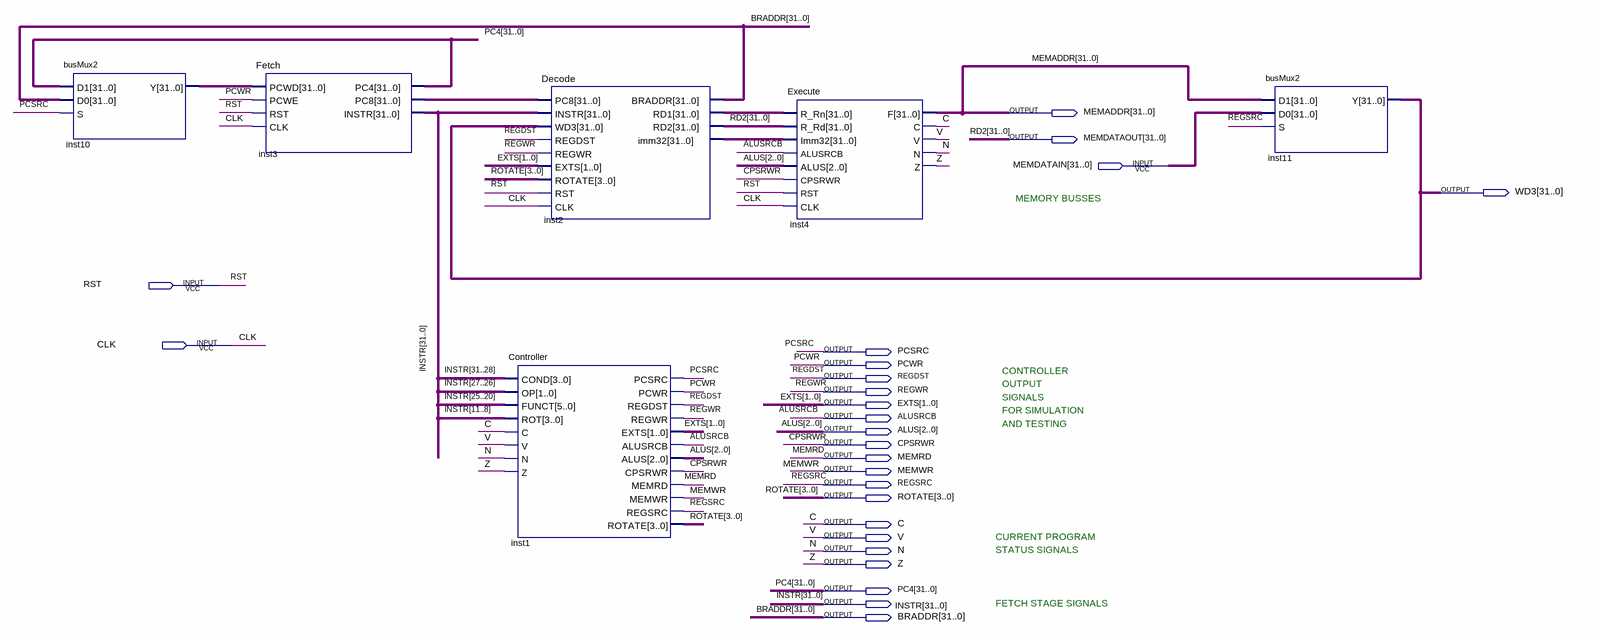
[diagram p0: schematic sheet]
// Quartus schematic SCP.bdf as structural Verilog: 6 symbols, 25 pins
module SCP (
  input  [31:0] MEMDATAIN,
  input  RST,
  input  CLK,
  output [31:0] MEMADDR,
  output [31:0] MEMDATAOUT,
  output [31:0] WD3,
  output PCSRC,
  output PCWR,
  output REGDST,
  output REGWR,
  output [1:0] EXTS,
  output ALUSRCB,
  output [2:0] ALUS,
  output CPSRWR,
  output MEMRD,
  output MEMWR,
  output REGSRC,
  output [3:0] ROTATE,
  output C,
  output V,
  output N,
  output Z,
  output [31:0] PC4,
  output [31:0] INSTR,
  output [31:0] BRADDR
);

  wire [31:0] inst2_imm32, inst2_rd1, inst3_pc8, inst10_y;

  busMux2 inst10 (.D1(PC4), .D0(BRADDR), .S(PCSRC), .Y(inst10_y));
  Fetch inst3 (.PCWD(inst10_y), .PCWE(PCWR), .RST(RST), .CLK(CLK), .PC4(PC4), .PC8(inst3_pc8), .INSTR(INSTR));
  Decode inst2 (
    .PC8(inst3_pc8), .INSTR(INSTR), .WD3(WD3), .REGDST(REGDST), .REGWR(REGWR), .EXTS(EXTS), .ROTATE(ROTATE),
    .RST(RST), .CLK(CLK), .BRADDR(BRADDR), .RD1(inst2_rd1), .RD2(MEMDATAOUT), .imm32(inst2_imm32));
  Controller inst1 (
    .COND(INSTR[31:28]), .OP(INSTR[27:26]), .FUNCT(INSTR[25:20]), .ROT(INSTR[11:8]), .C(C), .V(V), .N(N),
    .Z(Z), .PCSRC(PCSRC), .PCWR(PCWR), .REGDST(REGDST), .REGWR(REGWR), .EXTS(EXTS), .ALUSRCB(ALUSRCB),
    .ALUS(ALUS), .CPSRWR(CPSRWR), .MEMRD(MEMRD), .MEMWR(MEMWR), .REGSRC(REGSRC), .ROTATE(ROTATE));
  Execute inst4 (
    .R_Rn(inst2_rd1), .R_Rd(MEMDATAOUT), .Imm32(inst2_imm32), .ALUSRCB(ALUSRCB), .ALUS(ALUS),
    .CPSRWR(CPSRWR), .RST(RST), .CLK(CLK), .F(MEMADDR), .C(C), .V(V), .N(N), .Z(Z));
  busMux2 inst11 (.D1(MEMADDR), .D0(MEMDATAIN), .S(REGSRC), .Y(WD3));

  // Other names for the same wires on the sheet: RD2[31:0] = MEMDATAOUT

  // Notes on the sheet:
  //   MEMORY BUSSES
  //   CONTROLLER
  //   OUTPUT
  //   SIGNALS
  //   FOR SIMULATION
  //   AND TESTING
  //   CURRENT PROGRAM
  //   STATUS SIGNALS
  //   FETCH STAGE SIGNALS
endmodule
